# Altium schematic sheet BrushedMotorDriver.SchDoc
size A
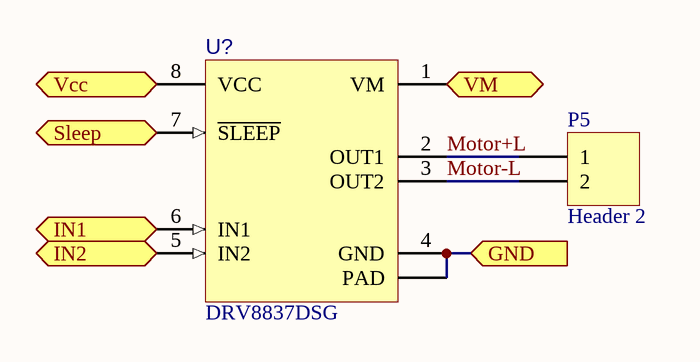
[diagram p0: BrushedMotorDriver.SchDoc]

## Parts
P5  Header 2  [HDR1X2]
U?  DRV8837DSG  [DSG0008A]

## Ports
GND (in), IN1 (in), IN2 (in), Sleep (in), Vcc (in), VM (in)

## Nets
GND: U?.4(GND) U?.9(PAD) ; port GND
IN1: U?.6(IN1) ; port IN1
IN2: U?.5(IN2) ; port IN2
Motor+L: P5.1 U?.2(OUT1)
Motor-L: P5.2 U?.3(OUT2)
Sleep: U?.7(~{SLEEP}) ; port Sleep
Vcc: U?.8(VCC) ; port Vcc
VM: U?.1(VM) ; port VM

## Library data of the parts
P5 = Header 2: Header, 2-Pin; LatestRevisionDate: 17-Jul-2002; LatestRevisionNote: Re-released for DXP Platform.; Publisher: Altium Limited
U? = DRV8837DSG: LOW-VOLTAGE H-BRIDGE IC, DSG0008A; Alternate Manufacturer: None; Manufacturer: Texas Instruments; SymbolCreator: a0411947; U/M: EA; SymbolVersion: 2013-08-22; PartNumber: DRV8837DSG; PackageReference: DSG0008A; MountType: SMT; ComponentLink1Description: Datasheet Link; ComponentLink1URL: http://www.ti.com/lit/ds/symlink/drv8837.pdf; CompType: IC; RoHS: Y; Publisher: Texas Instruments; LatestRevisionDate: 2013-09-10; LatestRevisionNote: Added Parts